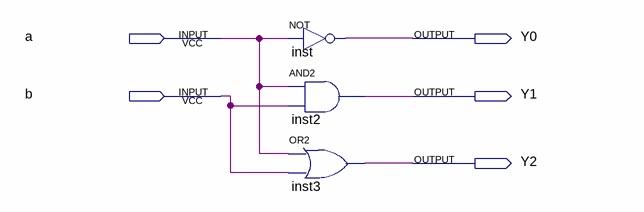
[diagram p0: schematic sheet]
// Quartus schematic 913010.bdf as structural Verilog: 3 symbols, 5 pins
module \913010  (
  input  a,
  input  b,
  output Y0,
  output Y1,
  output Y2
);

  not inst (Y0, a);
  and inst2 (Y1, a, b);
  or inst3 (Y2, a, b);
endmodule
